# Altium schematic sheet полная схема ДСД Bi.SchDoc
size A3; Date: 01.01.01; ApprovedBy: Петренко Н.И.; CheckedBy: Шиншилова З.Д.; CompanyName: ЛФВЭ ОИЯИ; Engineer: Люосев Д.А.; DocumentNumber: АБВГ.000000.000; SheetNumber: 1; SheetTotal: 2; Mass: 100; Material: Ясень; NameProduct: Форматка А3; NameProduct_1: Шла Саша по шоссе; NameProduct_2: и сосала сушку; Scale: 1:1; PageSetup: Record=PageOptions|CenterHorizontal=False|CenterVertical=False|PrintScale=1.00|XCorrection=1.00|YCorrection=1.00|PrintKind=0|BorderSize=5000000|LeftOffset=0|BottomOffset=0|Orientation=2|PaperLength=1000|PaperWidth=1000|Scale=100|PaperSource=7|PrintQuality=-3|MediaType=1|DitherType=10|PrintScaleMode=0|PaperKind=A3|PaperIndex=8
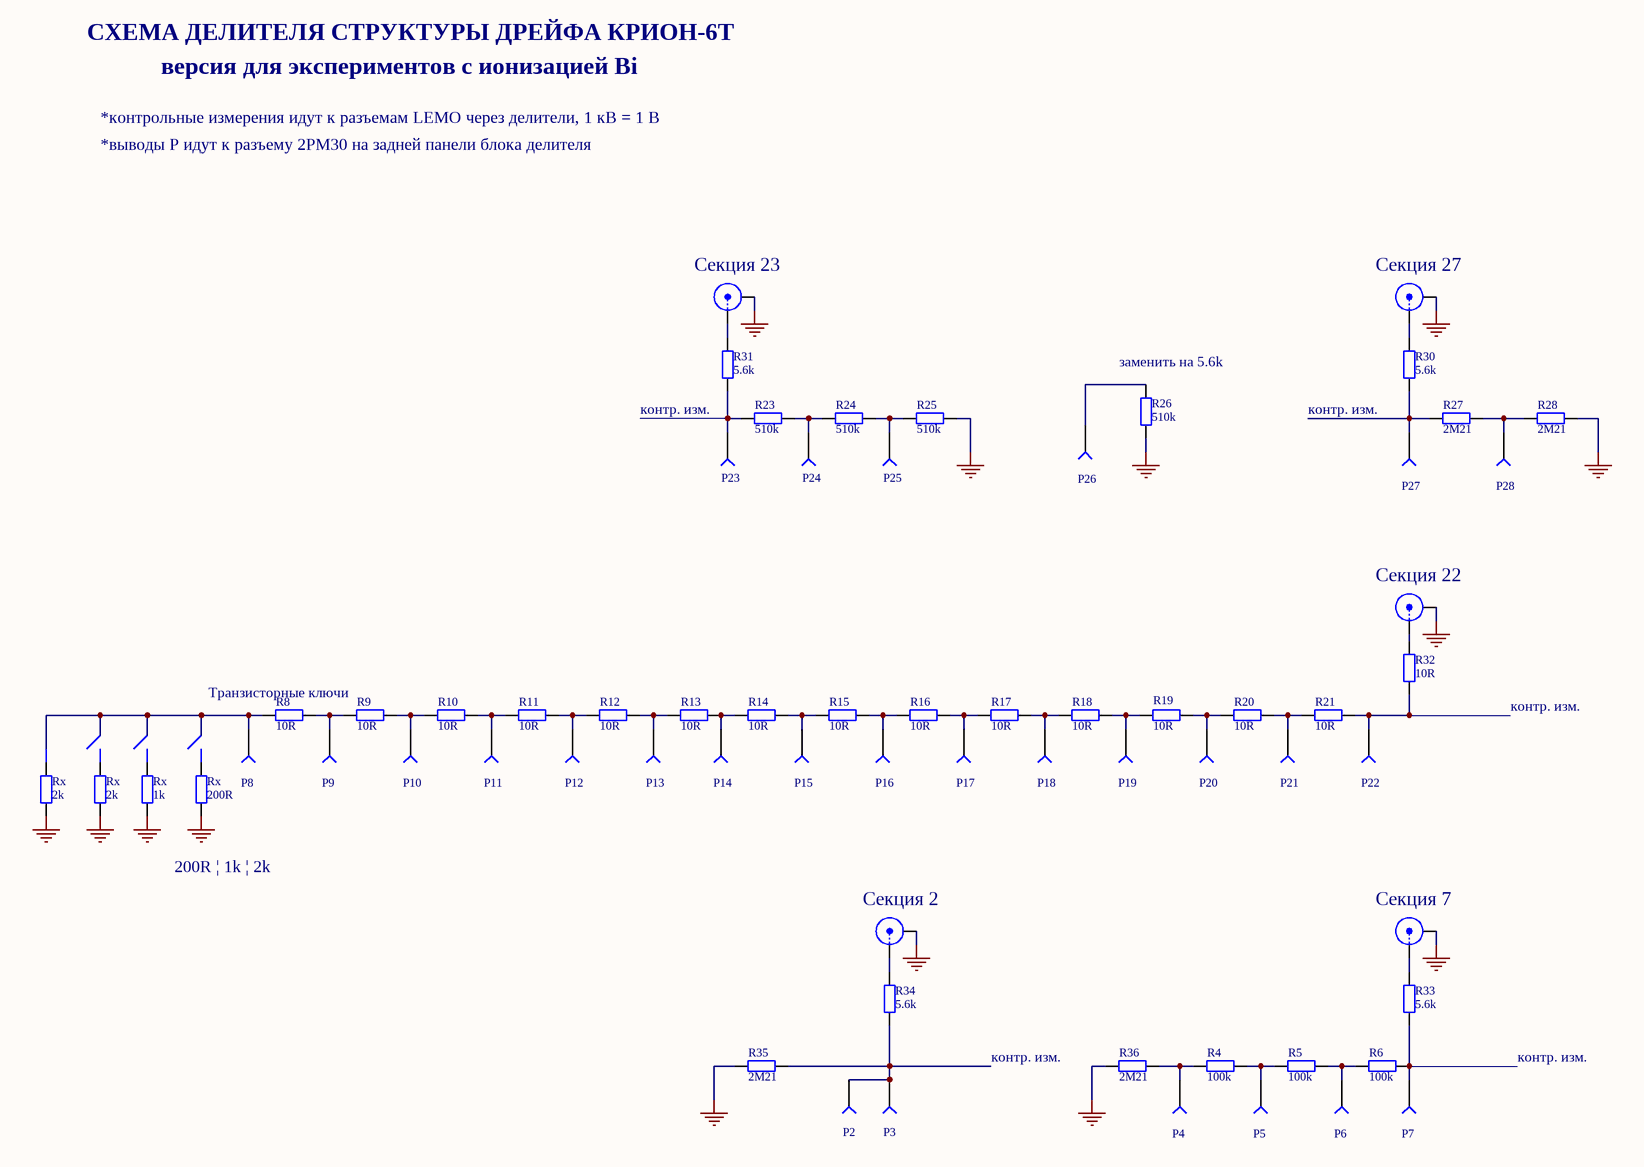
[diagram p0: полная схема ДСД Bi.SchDoc]

## Parts
(Parts that share a designator on the sheet are numbered #1, #2 ... from top to bottom, then left to right.)
P2  (no value)  [Pad 2x5mm]  (no BOM)
P3  (no value)  [Pad 2x5mm]  (no BOM)
P4  (no value)  [Pad 2x5mm]  (no BOM)
P5  (no value)  [Pad 2x5mm]  (no BOM)
P6  (no value)  [Pad 2x5mm]  (no BOM)
P7  (no value)  [Pad 2x5mm]  (no BOM)
P8  (no value)  [Pad 2x5mm]  (no BOM)
P9  (no value)  [Pad 2x5mm]  (no BOM)
P10  (no value)  [Pad 2x5mm]  (no BOM)
P11  (no value)  [Pad 2x5mm]  (no BOM)
P12  (no value)  [Pad 2x5mm]  (no BOM)
P13  (no value)  [Pad 2x5mm]  (no BOM)
P14  (no value)  [Pad 2x5mm]  (no BOM)
P15  (no value)  [Pad 2x5mm]  (no BOM)
P16  (no value)  [Pad 2x5mm]  (no BOM)
P17  (no value)  [Pad 2x5mm]  (no BOM)
P18  (no value)  [Pad 2x5mm]  (no BOM)
P19  (no value)  [Pad 2x5mm]  (no BOM)
P20  (no value)  [Pad 2x5mm]  (no BOM)
P21  (no value)  [Pad 2x5mm]  (no BOM)
P22  (no value)  [Pad 2x5mm]  (no BOM)
P23  (no value)  [Pad 2x5mm]  (no BOM)
P24  (no value)  [Pad 2x5mm]  (no BOM)
P25  (no value)  [Pad 2x5mm]  (no BOM)
P26  (no value)  [Pad 2x5mm]  (no BOM)
P27  (no value)  [Pad 2x5mm]  (no BOM)
P28  (no value)  [Pad 2x5mm]  (no BOM)
R4  value 100k  [Resistor ТВО-1 1W Horizontal]  (hidden comment: Resistor)
R5  value 100k  [Resistor ТВО-1 1W Horizontal]  (hidden comment: Resistor)
R6  value 100k  [Resistor ТВО-1 1W Horizontal]  (hidden comment: Resistor)
R8  value 10R  [Resistor ТВО-1 1W Horizontal]  (hidden comment: Resistor)
R9  value 10R  [Resistor ТВО-1 1W Horizontal]  (hidden comment: Resistor)
R10  value 10R  [Resistor ТВО-1 1W Horizontal]  (hidden comment: Resistor)
R11  value 10R  [Resistor ТВО-1 1W Horizontal]  (hidden comment: Resistor)
R12  value 10R  [Resistor ТВО-1 1W Horizontal]  (hidden comment: Resistor)
R13  value 10R  [Resistor ТВО-1 1W Horizontal]  (hidden comment: Resistor)
R14  value 10R  [Resistor ТВО-1 1W Horizontal]  (hidden comment: Resistor)
R15  value 10R  [Resistor ТВО-1 1W Horizontal]  (hidden comment: Resistor)
R16  value 10R  [Resistor ТВО-1 1W Horizontal]  (hidden comment: Resistor)
R17  value 10R  [Resistor ТВО-1 1W Horizontal]  (hidden comment: Resistor)
R18  value 10R  [Resistor ТВО-1 1W Horizontal]  (hidden comment: Resistor)
R19  value 10R  [Resistor ТВО-1 1W Horizontal]  (hidden comment: Resistor)
R20  value 10R  [Resistor ТВО-1 1W Horizontal]  (hidden comment: Resistor)
R21  value 10R  [Resistor ТВО-1 1W Horizontal]  (hidden comment: Resistor)
R23  510k  [Resistor ТВО-1 1W Horizontal]
R24  510k  [Resistor ТВО-1 1W Horizontal]
R25  510k  [Resistor ТВО-1 1W Horizontal]
R26  510k  [Resistor ТВО-1 1W Horizontal]
R27  value 2M21  [Resistor Р1-35-2 1W Horizontal]  (hidden comment: Resistor)
R28  value 2M21  [Resistor Р1-35-2 1W Horizontal]  (hidden comment: Resistor)
R30  value 5.6k  [Resistor ТВО-1 1W Horizontal]  (hidden comment: Resistor)
R31  5.6k  [Resistor ТВО-1 1W Horizontal]
R32  value 10R  [Resistor ТВО-1 1W Horizontal]  (hidden comment: Resistor)
R33  value 5.6k  [Resistor ТВО-1 1W Horizontal]  (hidden comment: Resistor)
R34  value 5.6k  [Resistor ТВО-1 1W Horizontal]  (hidden comment: Resistor)
R35  value 2M21  [Resistor Р1-35-2 1W Horizontal]  (hidden comment: Resistor)
R36  value 2M21  [Resistor Р1-35-2 1W Horizontal]  (hidden comment: Resistor)
Rx#1  value 2k  [Resistor ТВО-1 1W Horizontal]  (hidden comment: Resistor)
Rx#2  value 2k  [Resistor ТВО-1 1W Horizontal]  (hidden comment: Resistor)
Rx#3  value 1k  [Resistor ТВО-1 1W Horizontal]  (hidden comment: Resistor)
Rx#4  value 200R  [Resistor ТВО-1 1W Horizontal]  (hidden comment: Resistor)
Секция_2  HV-SYS  [HV-SYS]  (value not drawn)
Секция_7  HV-SYS  [HV-SYS]  (value not drawn)
Секция_22  HV-SYS  [HV-SYS]  (value not drawn)
Секция_23  HV-SYS  [HV-SYS]  (value not drawn)
Секция_27  HV-SYS  [HV-SYS]  (value not drawn)

## Nets
GND: R25.2 R26.1 R28.2 R35.2 R36.2 Rx#1.1 Rx#2.1 Rx#3.1 Rx#4.1 Секция_2.2(Y) Секция_7.2(Y) Секция_22.2(Y) Секция_23.2(Y) Секция_27.2(Y)
NetP2_1: P2.1 P3.1 R34.1 R35.1
NetP4_1: P4.1 R4.2 R36.1
NetP5_1: P5.1 R4.1 R5.2
NetP6_1: P6.1 R5.1 R6.2
NetP7_1: P7.1 R6.1 R33.1
NetP8_1: P8.1 R8.2
NetP9_1: P9.1 R8.1 R9.2
NetP10_1: P10.1 R9.1 R10.2
NetP11_1: P11.1 R10.1 R11.2
NetP12_1: P12.1 R11.1 R12.2
NetP13_1: P13.1 R12.1 R13.2
NetP14_1: P14.1 R13.1 R14.2
NetP15_1: P15.1 R14.1 R15.2
NetP16_1: P16.1 R15.1 R16.2
NetP17_1: P17.1 R16.1 R17.2
NetP18_1: P18.1 R17.1 R18.2
NetP19_1: P19.1 R18.1 R19.2
NetP20_1: P20.1 R19.1 R20.2
NetP21_1: P21.1 R20.1 R21.2
NetP22_1: P22.1 R21.1 R32.1
NetP23_1: P23.1 R23.1 R31.1
NetP24_1: P24.1 R23.2 R24.1
NetP25_1: P25.1 R24.2 R25.1
NetP26_1: P26.1 R26.2
NetP27_1: P27.1 R27.1 R30.1
NetP28_1: P28.1 R27.2 R28.1
NetR30_2: R30.2 Секция_27.1(X)
NetR31_2: R31.2 Секция_23.1(X)
NetR32_2: R32.2 Секция_22.1(X)
NetR33_2: R33.2 Секция_7.1(X)
NetR34_2: R34.2 Секция_2.1(X)

Not connected (* = marked no-connect by the designer): Rx#1 2; Rx#2 2; Rx#3 2; Rx#4 2

## Notes on the sheet
- СХЕМА ДЕЛИТЕЛЯ СТРУКТУРЫ ДРЕЙФА КРИОН-6Т
- *контрольные измерения идут к разъемам LEMO через делители, 1 кВ = 1 В
- версия для экспериментов c ионизацией Bi
- *выводы P идут к разъему 2РМ30 на задней панели блока делителя
- (near R26) заменить на 5.6k
- контр. изм.
- Транзисторные ключи
- (near R32) контр. изм.
- 200R | 1k | 2k
- Перв. примен.
- Справ. №
- Подп. и дата
- Инв.№дубл.
- Взам.инв.№
- Изм.
- Лист
- № докум.
- Подп.
- Дата
- Лит.
- Масса
- Масштаб
- Разраб.
- Пров.
- Т.контр.
- Листов
- Н.контр.
- Инв. №подл.
- Утв.

## Library data of the parts
P2-P28 = Socket
R4-R6 R8-R21 R27 R28 R30 R32-R36 Rx#1-Rx#4 = Resistors: Category: Резисторы; Type: *; Tolerance: *
R23-R26 R31 = Resistors: Resistor; Category: Резисторы; Type: *; Tolerance: *
  R23-R26: Value: 510k
  R31: Value: 5.6k
Секция_2 Секция_7 Секция_22 Секция_23 Секция_27 = HV-SYS: LHEP JINR HV SYS 3 kV connector; Coaxial Termination: Through Hole Right Angle; Coaxial Cable Types: -; Category: Разъёмы